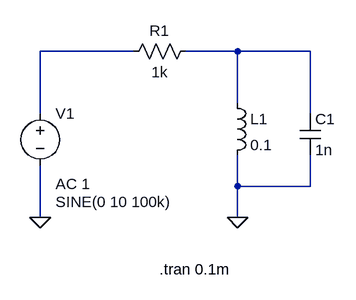
[diagram p0: schematic Band pass filter transient analysis.asc]
Band pass filter transient analysis.asc, the LTspice schematic file:
Version 4
SHEET 1 916 680
WIRE 272 16 128 16
WIRE 432 16 352 16
WIRE 544 16 432 16
WIRE 432 96 432 16
WIRE 128 112 128 16
WIRE 544 112 544 16
WIRE 432 224 432 176
WIRE 544 224 544 176
WIRE 544 224 432 224
WIRE 128 272 128 192
WIRE 432 272 432 224
FLAG 128 272 0
FLAG 432 272 0
SYMBOL voltage 128 96 R0
WINDOW 123 24 124 Left 2
WINDOW 39 0 0 Left 0
WINDOW 3 24 152 Left 2
SYMATTR Value2 AC 1
SYMATTR InstName V1
SYMATTR Value SINE(0 10 100k)
SYMBOL res 368 0 R90
WINDOW 0 0 56 VBottom 2
WINDOW 3 32 56 VTop 2
SYMATTR InstName R1
SYMATTR Value 1k
SYMBOL ind 416 80 R0
SYMATTR InstName L1
SYMATTR Value 0.1
SYMBOL cap 528 112 R0
SYMATTR InstName C1
SYMATTR Value 1n
TEXT 312 352 Left 2 !.tran 0.1m

The netlist it stands for:
* Band pass filter transient analysis.asc
V1 N001 0 SINE(0 10 100k) AC 1
R1 N002 N001 1k
L1 N002 0 0.1
C1 N002 0 1n
.tran 0.1m
.backanno
.end